# Altium project meltdown_protection.PrjPcb
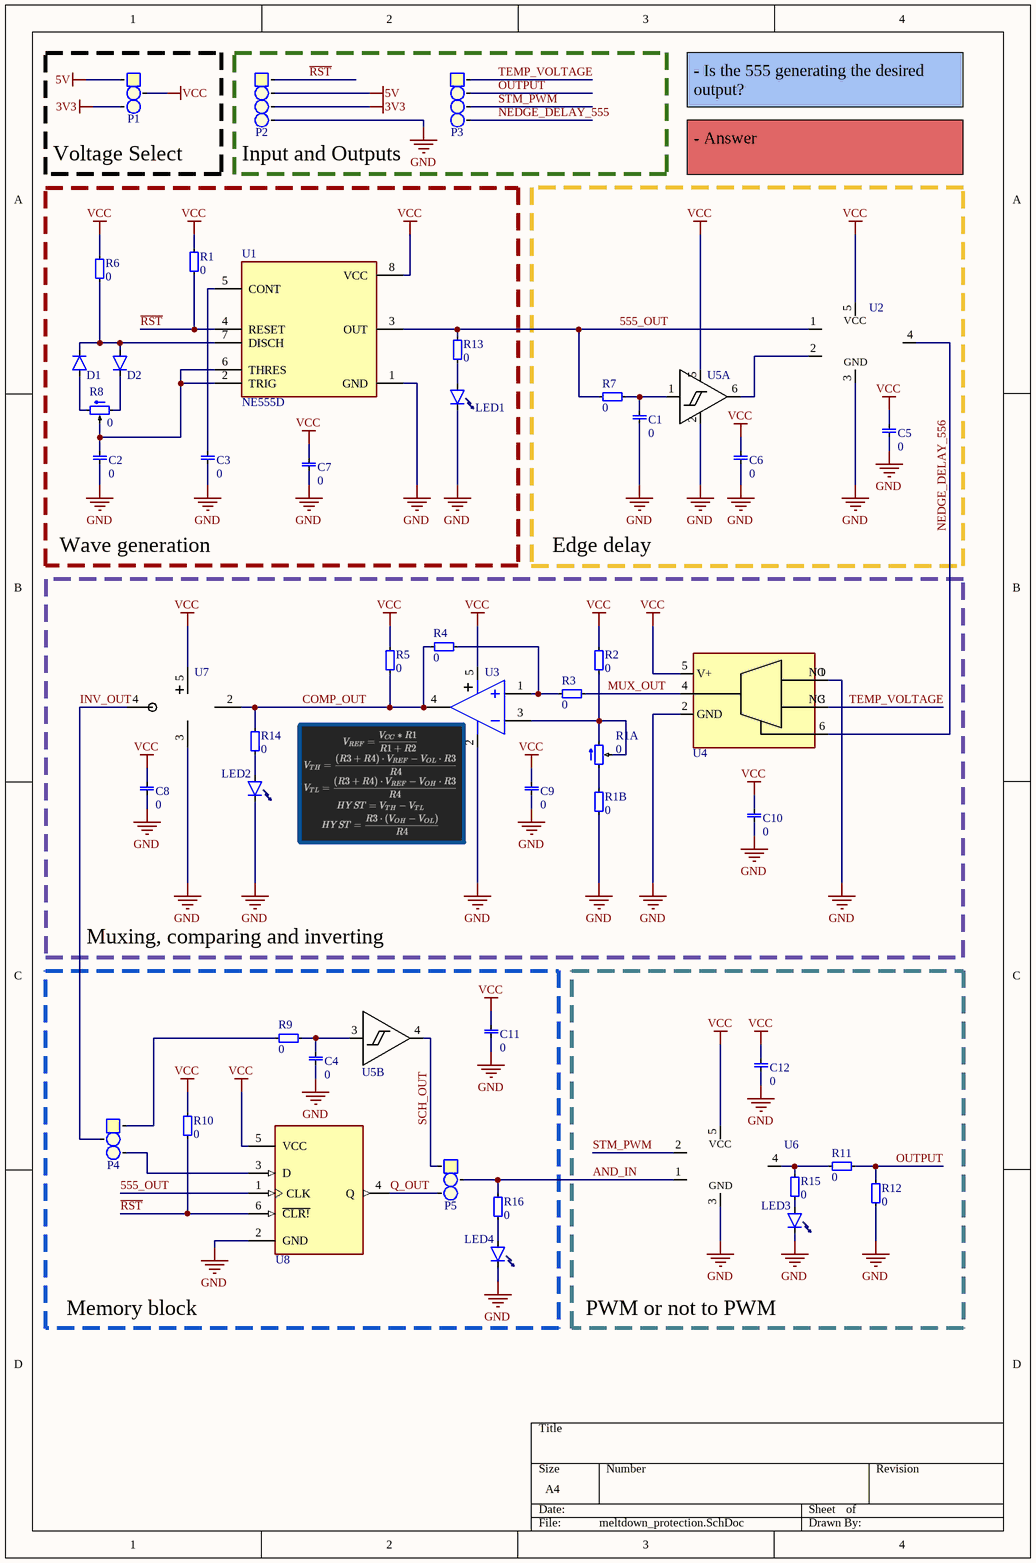
[diagram p0: meltdown_protection.SchDoc]
1 sheet, 49 parts. Net scope: global (net labels, ports and power ports of the same name join across sheets).
Board file: meltdown_protection.PcbDoc

## Sheet meltdown_protection.SchDoc
size A4 portrait; SheetNumber: 1; SheetTotal: 1

### Parts
C1  value 0  [0603 cap]  (hidden comment: 0603, capacitor)
C2  value 0  [0603 cap]  (hidden comment: 0603, capacitor)
C3  value 0  [0603 cap]  (hidden comment: 0603, capacitor)
C4  value 0  [0603 cap]  (hidden comment: 0603, capacitor)
C5  value 0  [0603 cap]  (hidden comment: 0603, capacitor)
C6  value 0  [0603 cap]  (hidden comment: 0603, capacitor)
C7  value 0  [0603 cap]  (hidden comment: 0603, capacitor)
C8  value 0  [0603 cap]  (hidden comment: 0603, capacitor)
C9  value 0  [0603 cap]  (hidden comment: 0603, capacitor)
C10  value 0  [0603 cap]  (hidden comment: 0603, capacitor)
C11  value 0  [0603 cap]  (hidden comment: 0603, capacitor)
C12  value 0  [0603 cap]  (hidden comment: 0603, capacitor)
D1  Diode, SMD  [SOD323]  (value not drawn)
D2  Diode, SMD  [SOD323]  (value not drawn)
LED1  0805, LED  [0805_led]  (value not drawn)
LED2  0805, LED  [0805_led]  (value not drawn)
LED3  0805, LED  [0805_led]  (value not drawn)
LED4  0805, LED  [0805_led]  (value not drawn)
P1  1x3 Pin Header Mux  [padThree_L]  (value not drawn)
P2  4x1 Pin Header  [padFour_L]  (value not drawn)
P3  4x1 Pin Header  [padFour_L]  (value not drawn)
P4  1x3 Pin Header Mux  [padThree_L]  (value not drawn)
P5  1x3 Pin Header Mux  [padThree_L]  (value not drawn)
R1  value 0  [0603]  (hidden comment: 0603, resistor)
R1A  value 0  [PV36W104C01B00]  (hidden comment: Pot)
R1B  value 0  [0603]  (hidden comment: 0603, resistor)
R2  value 0  [0603]  (hidden comment: 0603, resistor)
R3  value 0  [0603]  (hidden comment: 0603, resistor)
R4  value 0  [0603]  (hidden comment: 0603, resistor)
R5  value 0  [0603]  (hidden comment: 0603, resistor)
R6  value 0  [0603]  (hidden comment: 0603, resistor)
R7  value 0  [0603]  (hidden comment: 0603, resistor)
R8  value 0  [PV36W104C01B00]  (hidden comment: Pot)
R9  value 0  [0603]  (hidden comment: 0603, resistor)
R10  value 0  [0603]  (hidden comment: 0603, resistor)
R11  value 0  [0603]  (hidden comment: 0603, resistor)
R12  value 0  [0603]  (hidden comment: 0603, resistor)
R13  value 0  [0603]  (hidden comment: 0603, resistor)
R14  value 0  [0603]  (hidden comment: 0603, resistor)
R15  value 0  [0603]  (hidden comment: 0603, resistor)
R16  value 0  [0603]  (hidden comment: 0603, resistor)
U1  NE555D  [SOIC8]
U2  SN74LVC1G32DBVT  [SOT23-5]  (value not drawn)
U3  MCP6V66UT-E/LTY  [SC70P210X110-5N]  (value not drawn)
U4  TS5A3159DCKR  [SOT65P210X110-6N]  (value not drawn)
U5  SN74LVC2G17DBVT  [SOT95P280X145-6N]  (value not drawn)  (parts A,B of 2)
U6  SN74LVC1G08DBVR  [SOT95P280X145-5N]  (value not drawn)
U7  SN74LVC1G04DBVR  [SOT95P280X145-5N]  (value not drawn)
U8  SN74LVC1G175DBVR  [SOT95P280X145-6N]  (value not drawn)

### Blocks framed on the sheet
Voltage Select: P1
Input and Outputs: P2 P3
Wave generation: C2 C3 C7 D1 D2 LED1 R1 R6 R8 R13 U1
Edge delay: C1 C5 C6 R7 U2 U5
Muxing, comparing and inverting: C8-C10 LED2 R1A R1B R2-R5 R14 U3 U4 U7
Memory block: C4 C11 LED4 P4 P5 R9 R10 R16 U5 U8
PWM or not to PWM: C12 LED3 R11 R12 R15 U6

### Nets
3V3: P1.3 P2.3
5V: P1.1 P2.2
GND: C1.0 C2.0 C3.0 C4.0 C5.0 C6.0 C7.0 C8.0 C9.0 C10.0 C11.0 C12.0 LED1.0(Cathode) LED2.0(Cathode) LED3.0(Cathode) LED4.0(Cathode) P2.4 R1B.1 R12.1 U1.1(GND) U2.3(GND) U3.2(V-) U4.1(NO) U4.2(GND) U5.2(GND) U6.3(GND) U7.3(GND) U8.2(GND)
VCC: C5.1 C6.1 C7.1 C8.1 C9.1 C10.1 C11.1 C12.1 P1.2 R1.0 R2.0 R5.1 R6.0 R10.1 U1.8(VCC) U2.5(VCC) U3.5(V+) U4.5(V+) U5.5(VCC) U6.5(VCC) U7.5(VCC) U8.5(VCC)
555_OUT: R7.1 R13.0 U1.3(OUT) U2.1(A) U8.1(CLK)
AND_IN: P5.2 R16.0 U6.1(A)
COMP_OUT: R4.1 R5.0 R14.0 U3.4(OUT) U7.2(A)
INV_OUT: P4.2 U7.4(Y)
MUX_OUT: R3.0 U4.4(COM)
NEDGE_DELAY_555: P3.4
NEDGE_DELAY_556: U2.4(Y) U4.6(IN)
OUTPUT: P3.2 R11.0 R12.0
Q_OUT: P5.3 U8.4(Q)
~{RST}: P2.1 R1.1 R10.0 U1.4(RESET) U8.6(~{CLR!})
SCH_OUT: P5.1 U5.4(2Y)
STM_PWM: P3.3 U6.2(B)
TEMP_VOLTAGE: P3.1 U4.3(NC)
NetC1_1: C1.1 R7.0 U5.1(1A)
NetC2_1: C2.1 R8.2 U1.2(TRIG) U1.6(THRES)
NetC3_1: C3.1 U1.5(CONT)
NetC4_1: C4.1 R9.0 U5.3(2A)
NetD1_1: D1.1 D2.2 R6.1 U1.7(DISCH)
NetD1_2: D1.2 R8.3
NetD2_1: D2.1 R8.1
NetLED1_1: LED1.1 R13.1
NetLED2_1: LED2.1 R14.1
NetLED3_1: LED3.1 R15.1
NetLED4_1: LED4.1 R16.1
NetP4_1: P4.1 R9.1
NetP4_3: P4.3 U8.3(D)
NetR1A_1: R1A.1 R1B.0
NetR1A_2: R1A.2 R1A.3 R2.1 U3.3(IN-)
NetR3_1: R3.1 R4.0 U3.1(IN+)
NetR11_1: R11.1 R15.0 U6.4(Y)
NetU2_2: U2.2(B) U5.6(1Y)

### Notes on the sheet
- - Is the 555 generating the desired output?
- - Answer

### Library data of the parts
LED1-LED4 = 0805, LED: Value: 0805 LED
P1 P4 P5 = 1x3 Pin Header Mux: 2.54 mm; Value: 1x3 Pin Header
P2 P3 = 1x4 Pin Header: 2.54 mm; Value: 4x1 Pin Header
U2 = SN74LVC1G32DBVT: Single 2-input, 1.65-V to 5.5-V OR gate; MF: Texas Instruments; Package: SOT-23-5 Texas Instruments; Value: *; Purchase-URL: https://pricing.snapeda.com/search/part/SN74LVC1G32DBVT/?ref=eda; Availability: In Stock; SnapEDA_Link: https://www.snapeda.com/parts/SN74LVC1G32DBVT/Texas+Instruments/view-part/?ref=snap; Price: None; MP: SN74LVC1G32DBVT; Check_prices: https://www.snapeda.com/parts/SN74LVC1G32DBVT/Texas+Instruments/view-part/?ref=eda
U3 = MCP6V66UT-E/LTY: Linear High Precision Op Amps-Chopper Stabilized, 1000kHz, 1.8Vto5.5V, SC70-5, RoHS; Manufacturer: Microchip; Supplier 1: Avnet; Manufacturer Part Number: MCP6V66UT-E/LTY; RoHS: No; Category: Amplifiers - Op Amps, Buffer, Instrumentation; Stock 1: 50; Pricing 1: 3000=0,93150 (USD); Supplier Part Number 1: MCP6V66UT-E/LTY
U4 = TS5A3159DCKR: 1-?, 5-V, 2:1 (SPDT), 1-channel analog switch 6-SC70 -40 to 85; MF: Texas Instruments; MP: TS5A3159DCKR; Check_prices: https://www.snapeda.com/parts/TS5A3159DCKR/Texas%20Instruments/view-part/303403/?ref=eda; Package: SOT-SC70-6 Texas Instruments; SnapEDA_Link: https://www.snapeda.com/parts/TS5A3159DCKR/Texas%20Instruments/view-part/303403/?ref=snap; Value: *; Price: None; Availability: In Stock; Purchase-URL: https://pricing.snapeda.com/search/part/TS5A3159DCKR/?ref=eda
U5 = SN74LVC2G17DBVT: Dual Schmitt-Trigger Buffer; MF: Texas Instruments; DigiKey-Purchase-URL: https://snapeda.com/shop?store=DigiKey&id=466474; Mouser-Purchase-URL: https://snapeda.com/shop?store=Mouser&id=466474; Value: *; MP: SN74LVC2G17DBVT; Availability: Unavailable; Price: None; Texas_Instruments-Purchase-URL: https://snapeda.com/shop?store=Texas+Instruments&id=466474; Package: SOT-23-6 Texas Instruments; SnapEDA_Link: https://www.snapeda.com/parts/SN74LVC2G17DBVT/Texas%20Instruments/view-part/466474/?ref=snap
U6 = SN74LVC1G08DBVR: Single 2-Input Positive-AND Gate 5-SOT-23 -40 to 125; MF: Texas Instruments; Package: SOT-23-5 Texas Instruments; Availability: Unavailable; Texas_Instruments-Purchase-URL: https://snapeda.com/shop?store=Texas+Instruments&id=78735; MP: SN74LVC1G08DBVR; SnapEDA_Link: https://www.snapeda.com/parts/SN74LVC1G08DBVR/Texas%20Instruments/view-part/78735/?ref=snap; Value: *; Price: None
U7 = SN74LVC1G04DBVR: Single Inverter 5-SOT-23 -40 to 125; Value: *; Availability: Unavailable; Package: None; MP: SN74LVC1G04DBVR; Price: None
U8 = SN74LVC1G175DBVR: Single D-Type Flip-Flop with Asynchronous Clear 6-SOT-23 -40 to 125; MF: Texas Instruments; MP: SN74LVC1G175DBVR; Purchase-URL: https://pricing.snapeda.com/search/part/SN74LVC1G175DBVR/?ref=eda; SnapEDA_Link: https://www.snapeda.com/parts/SN74LVC1G175DBVR/Texas%20Instruments/view-part/473666/?ref=snap; Package: SOT-23-6 Texas Instruments; Check_prices: https://www.snapeda.com/parts/SN74LVC1G175DBVR/Texas%20Instruments/view-part/473666/?ref=eda; Digi-Key_Part_Number: 296-17617-1-ND; Value: *
C1-C12 = 0603, capacitor: Order number: *
U1 = NE555D: Price: None; MP: NE555D; Value: *; Availability: Unavailable; Package: None